# Altium schematic sheet [03] - POWER MANAGEMENT.SchDoc
size A3; DocumentNumber: 3; SheetNumber: 3; SheetTotal: 13; NameAuthor: Angle Vu
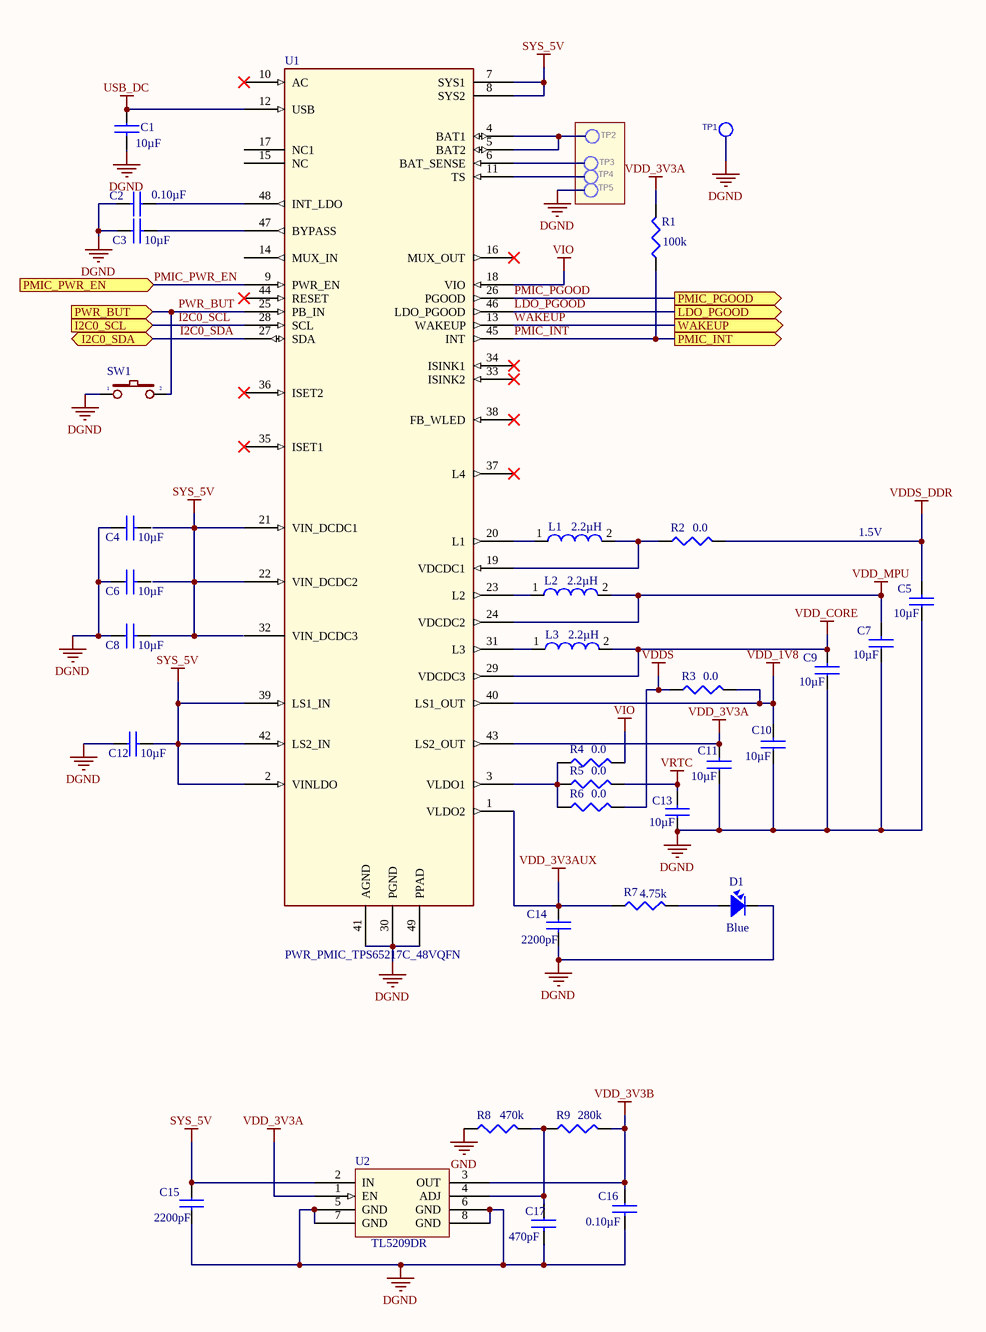
[diagram p0: [03] - POWER MANAGEMENT.SchDoc]

## Parts
C1  Capacitance: 10µF  (hidden comment: C_CER_10uF_10V_X7R_0805_10%)
C2  Capacitance: 0.10µF  (hidden comment: C_CER_0.1uF_6.3V_X5R_0402_10%)
C3  Capacitance: 10µF  (hidden comment: C_CER_10uF_10V_X7R_0805_10%)
C4  Capacitance: 10µF  (hidden comment: C_CER_10uF_10V_X7R_0805_10%)
C5  Capacitance: 10µF  (hidden comment: C_CER_10uF_10V_X7R_0805_10%)
C6  Capacitance: 10µF  (hidden comment: C_CER_10uF_10V_X7R_0805_10%)
C7  Capacitance: 10µF  (hidden comment: C_CER_10uF_10V_X7R_0805_10%)
C8  Capacitance: 10µF  (hidden comment: C_CER_10uF_10V_X7R_0805_10%)
C9  Capacitance: 10µF  (hidden comment: C_CER_10uF_10V_X7R_0805_10%)
C10  Capacitance: 10µF  (hidden comment: C_CER_10uF_10V_X7R_0805_10%)
C11  Capacitance: 10µF  (hidden comment: C_CER_10uF_10V_X7R_0805_10%)
C12  Capacitance: 10µF  (hidden comment: C_CER_10uF_10V_X7R_0805_10%)
C13  Capacitance: 10µF  (hidden comment: C_CER_10uF_10V_X7R_0805_10%)
C14  Capacitance: 2200pF  (hidden comment: C_CER_2200pF_10V_X5R_0402_10%)
C15  Capacitance: 2200pF  (hidden comment: C_CER_2200pF_10V_X5R_0402_10%)
C16  Capacitance: 0.10µF  (hidden comment: C_CER_0.1uF_6.3V_X5R_0402_10%)
C17  Capacitance: 470pF  (hidden comment: C_CER_470pF_50V_X7R_0402_10%)
D1  Color: Blue  (hidden comment: LED_BLUE_0603)
L1  Inductance: 2.2µH  (hidden comment: INDUCTOR_2.2uH_1.3A_1008_20%)
L2  Inductance: 2.2µH  (hidden comment: INDUCTOR_2.2uH_1.3A_1008_20%)
L3  Inductance: 2.2µH  (hidden comment: INDUCTOR_2.2uH_1.3A_1008_20%)
R1  Resistance (Ohms): 100k  (hidden comment: R_100k_1/16W_0402_1%)
R2  Resistance (Ohms): 0.0  (hidden comment: R_0OhM_1/16W_0402)
R3  Resistance (Ohms): 0.0  (hidden comment: R_0OhM_1/16W_0402)
R4  Resistance (Ohms): 0.0  (hidden comment: R_0OhM_1/16W_0402)
R5  Resistance (Ohms): 0.0  (hidden comment: R_0OhM_1/16W_0402)
R6  Resistance (Ohms): 0.0  (hidden comment: R_0OhM_1/16W_0402)
R7  Resistance (Ohms): 4.75k  (hidden comment: R_4.75K_1/16W_0402_1%)
R8  Resistance (Ohms): 470k  (hidden comment: R_470K_1/16W_0402_1%)
R9  Resistance (Ohms): 280k  (hidden comment: R_280K_1/16W_0402_1%)
SW1  SW2_DPST_SURFACE_5MM  [SW2-SMD]  (value not drawn)
TP1  TESTPT1  [TP60C_SMD]  (value not drawn)  (no BOM)
TP2  TESTPT1  [TP60C_SMD]  (value not drawn)  (no BOM)
TP3  TESTPT1  [TP60C_SMD]  (value not drawn)  (no BOM)
TP4  TESTPT1  [TP60C_SMD]  (value not drawn)  (no BOM)
TP5  TESTPT1  [TP60C_SMD]  (value not drawn)  (no BOM)
U1  PWR_PMIC_TPS65217C_48VQFN
U2  Manufacturer Part Number: TL5209DR  (hidden comment: PWR_LDO_TL5209D_0.5A_ADJ_8SOIC)

## Ports
I2C0_SCL (in), I2C0_SDA (bidir), LDO_PGOOD (out), PMIC_INT (out), PMIC_PGOOD (out), PMIC_PWR_EN (in), PWR_BUT (in), WAKEUP (out)

## Nets
DGND: C1.2 C2.2 C3.1 C4.1 C5.1 C6.1 C7.1 C8.1 C9.1 C10.1 C11.1 C12.1 C13.1 C14.2 C15.2 C16.2 C17.2 D1.2 SW1.1 TP1.1(TP) TP5.1(TP) U1.30(PGND) U1.41(AGND) U1.49(PPAD) U2.5(GND) U2.6(GND) U2.7(GND) U2.8(GND)
GND: R8.1
SYS_5V: C8.2 C12.2 C15.1 U1.2(VINLDO) U1.7(SYS1) U1.8(SYS2) U1.21(VIN_DCDC1) U1.22(VIN_DCDC2) U1.39(LS1_IN) U1.42(LS2_IN) U2.2(IN)
USB_DC: C1.1 U1.12(USB)
VDD_1V8: C10.2 R3.2 U1.40(LS1_OUT)
VDD_3V3A: C11.2 R1.2 U1.43(LS2_OUT) U2.1(EN)
VDD_3V3AUX: C14.1 R7.1 U1.1(VLDO2)
VDD_3V3B: C16.1 R9.2 U2.3(OUT)
VDD_CORE: C9.2 L3.2 U1.29(VDCDC3)
VDD_MPU: C7.2 L2.2 U1.24(VDCDC2)
VDDS: R3.1 R6.2
VDDS_DDR: C5.2 R2.2
VIO: R4.2 U1.18(VIO)
VRTC: C13.2 R5.2
I2C0_SCL: U1.28(SCL) ; port I2C0_SCL
I2C0_SDA: U1.27(SDA) ; port I2C0_SDA
LDO_PGOOD: U1.46(LDO_PGOOD) ; port LDO_PGOOD
PMIC_INT: R1.1 U1.45(INT) ; port PMIC_INT
PMIC_PGOOD: U1.26(PGOOD) ; port PMIC_PGOOD
PMIC_PWR_EN: U1.9(PWR_EN) ; port PMIC_PWR_EN
PWR_BUT: SW1.2 U1.25(PB_IN) ; port PWR_BUT
WAKEUP: U1.13(WAKEUP) ; port WAKEUP
NetC2_1: C2.1 U1.48(INT_LDO)
NetC3_2: C3.2 U1.47(BYPASS)
NetC17_1: C17.1 R8.2 R9.1 U2.4(ADJ)
NetD1_1: D1.1 R7.2
NetL1_1: L1.1 U1.20(L1)
NetL1_2: L1.2 R2.1 U1.19(VDCDC1)
NetL2_1: L2.1 U1.23(L2)
NetL3_1: L3.1 U1.31(L3)
NetR4_1: R4.1 R5.1 R6.1 U1.3(VLDO1)
NetTP2_1: TP2.1(TP) U1.4(BAT1) U1.5(BAT2)
NetTP3_1: TP3.1(TP) U1.6(BAT_SENSE)
NetTP4_1: TP4.1(TP) U1.11(TS)

Not connected (* = marked no-connect by the designer): C4 2; C6 2; U1 10(AC)* 14(MUX_IN) 15(NC) 16(MUX_OUT)* 17(NC1) 32(VIN_DCDC3) 33(ISINK2)* 34(ISINK1)* 35(ISET1)* 36(ISET2)* 37(L4)* 38(FB_WLED)* 44(RESET)*

## Notes on the sheet
- 1.5V
- Designed By
- Page Name:
- Checked By
- Size:
- A3
- Company:
- Address:
- Sheet:
- /

## Library data of the parts
C1 C3-C13 = C_CER_10uF_10V_X7R_0805_10%: CAP CER 10UF 10V X7R 0805; Manufacturer: Murata Electronics North America; Manufacturer Part Number: GRM21BR71A106KE51L; Tolerance: ±10%; Supplier 1: Digi-Key; RoHS: RoHS Compliant; Category: Capacitors; Stock 1: 966000; Pricing 1: 3000=0.05, 6000=0.04625, 9000=0.04375, 15000=0.0415, 30000=0.04, 75000=0.0375, 150000=0.03313 (USD); Packaging: Tape & Reel (TR); Part Status: Active; Temperature Coefficient: X7R; Operating Temperature: -55°C ~ 125°C; Features: -; Ratings: -; Applications: General Purpose; Failure Rate: *; Mounting Type: Surface Mount, MLCC; Package / Case: 0805 (2012 Metric); Size / Dimension: 0.079" L x 0.049" W (2.00mm x 1.25mm); Height - Seated (Max): -; Thickness (Max): 0.053" (1.35mm); Lead Spacing: -; Lead Style: -; ComponentLink1URL: http://www.murata.com/~/media/webrenewal/support/library/catalog/products/capacitor/mlcc/c02e.pdf; ComponentLink1Description: http://www.murata.com/~/media/webrenewal/support/library/catalog/products/capacitor/mlcc/c02e.pdf; Supplier Part Number 1: 490-3905-2-ND
C2 C16 = C_CER_0.1uF_6.3V_X5R_0402_10%: CAP CER 0.1UF 6.3V X5R 0402; Manufacturer: Murata Electronics North America; Manufacturer Part Number: GRM155R60J104KA01D; Tolerance: ±10%; Supplier 1: Digi-Key; RoHS: RoHS Compliant; Category: Capacitors; Stock 1: 370000; Pricing 1: 10000=0.0021, 20000=0.002, 30000=0.0019, 50000=0.0017, 100000=0.00138 (USD); Packaging: Tape & Reel (TR); Part Status: Active; Voltage - Rated: 6.3V; Temperature Coefficient: X5R; Operating Temperature: -55°C ~ 85°C; Features: -; Ratings: -; Applications: General Purpose; Failure Rate: *; Mounting Type: Surface Mount, MLCC; Package / Case: 0402 (1005 Metric); Size / Dimension: 0.039" L x 0.020" W (1.00mm x 0.50mm); Height - Seated (Max): -; Thickness (Max): 0.022" (0.55mm); Lead Spacing: -; Lead Style: -; ComponentLink1URL: http://www.murata.com/~/media/webrenewal/support/library/catalog/products/capacitor/mlcc/c02e.pdf; ComponentLink1Description: http://www.murata.com/~/media/webrenewal/support/library/catalog/products/capacitor/mlcc/c02e.pdf; Supplier Part Number 1: 490-6287-2-ND
C14 C15 = C_CER_2200pF_10V_X5R_0402_10%: CAP CER 2200PF 10V X5R 0402; Manufacturer: Murata Electronics North America; Manufacturer Part Number: GRM155R61A222KA01D; Tolerance: ±10%; Supplier 1: Digi-Key; RoHS: RoHS Compliant; Category: Capacitors; Stock 1: 30000; Pricing 1: 10000=0.00399, 20000=0.0038, 30000=0.00361, 50000=0.00323, 100000=0.00261 (USD); Packaging: Tape & Reel (TR); Part Status: Active; Voltage - Rated: 10V; Temperature Coefficient: X5R; Operating Temperature: -55°C ~ 85°C; Features: -; Ratings: -; Applications: General Purpose; Failure Rate: *; Mounting Type: Surface Mount, MLCC; Package / Case: 0402 (1005 Metric); Size / Dimension: 0.039" L x 0.020" W (1.00mm x 0.50mm); Height - Seated (Max): -; Thickness (Max): 0.022" (0.55mm); Lead Spacing: -; Lead Style: -; ComponentLink1URL: http://www.murata.com/~/media/webrenewal/support/library/catalog/products/capacitor/mlcc/c02e.pdf; ComponentLink1Description: http://www.murata.com/~/media/webrenewal/support/library/catalog/products/capacitor/mlcc/c02e.pdf; Supplier Part Number 1: 490-8251-2-ND
C17 = C_CER_470pF_50V_X7R_0402_10%: CAP CER 470PF 50V X7R 0402; Manufacturer: Murata Electronics North America; Manufacturer Part Number: GRM155R71H471KA01D; Tolerance: ±10%; Supplier 1: Digi-Key; RoHS: RoHS Compliant; Category: Capacitors; Stock 1: 654393; Pricing 1: 1=0.1, 10=0.018, 50=0.0098, 100=0.0083, 250=0.00676, 500=0.00578, 1000=0.0045, 5000=0.00375 (USD); Packaging: Cut Tape (CT); Part Status: Active; Voltage - Rated: 50V; Temperature Coefficient: X7R; Operating Temperature: -55°C ~ 125°C; Features: -; Ratings: -; Applications: General Purpose; Failure Rate: *; Mounting Type: Surface Mount, MLCC; Package / Case: 0402 (1005 Metric); Size / Dimension: 0.039" L x 0.020" W (1.00mm x 0.50mm); Height - Seated (Max): -; Thickness (Max): 0.022" (0.55mm); Lead Spacing: -; Lead Style: -; ComponentLink1URL: http://www.murata.com/~/media/webrenewal/support/library/catalog/products/capacitor/mlcc/c02e.pdf; ComponentLink1Description: http://www.murata.com/~/media/webrenewal/support/library/catalog/products/capacitor/mlcc/c02e.pdf; Supplier Part Number 1: 490-1300-1-ND
D1 = LED_BLUE_0603: LED BLUE CLEAR 0603 SMD; Manufacturer: Lite-On Inc.; Manufacturer Part Number: LTST-C191TBKT; Lens Color: Colorless; Millicandela Rating: 104mcd; Lens Style/Size: Rectangle with Flat Top, 1.10mm x 0.80mm; Voltage - Forward (Vf) (Typ): 3.3V; Current - Test: 20mA; Viewing Angle: 130°; Wavelength - Dominant: 470nm; Wavelength - Peak: 468nm; Supplier 1: Digi-Key; RoHS: RoHS Compliant; Category: Optoelectronics; Stock 1: 135000; Pricing 1: 5000=0.0684, 10000=0.0608, 25000=0.057, 50000=0.0513, 125000=0.0494 (USD); Packaging: Tape & Reel (TR); Part Status: Active; Lens Transparency: Clear; Mounting Type: Surface Mount; Features: -; Package / Case: 0603 (1608 Metric); Supplier Device Package: *; Size / Dimension: 1.60mm L x 0.80mm W; Height (Max): 0.55mm; ComponentLink1URL: http://optoelectronics.liteon.com/upload/download/DS22-2000-230/S_110_LTST-C191TBKT.pdf; ComponentLink1Description: http://optoelectronics.liteon.com/upload/download/DS22-2000-230/S_110_LTST-C191TBKT.pdf
L1-L3 = INDUCTOR_2.2uH_1.3A_1008_20%: FIXED IND 2.2UH 1.3A 80 MOHM SMD; Manufacturer: Murata Electronics North America; Manufacturer Part Number: LQM2HPN2R2MG0L; Type: Multilayer; Material - Core: Ferrite; Tolerance: ±20%; Shielding: Shielded; DC Resistance (DCR): 100 mOhm Max; Frequency - Self Resonant: 40MHz; Frequency - Test: 1MHz; Supplier 1: Digi-Key; RoHS: RoHS Compliant; Category: Inductors, Coils, Chokes; Stock 1: 216000; Pricing 1: 3000=0.11594, 6000=0.10912, 15000=0.10571, 30000=0.1023, 75000=0.09889, 150000=0.09548 (USD); Packaging: Tape & Reel (TR); Part Status: Active; Current Rating: 1.3A; Current - Saturation: -; Q @ Freq: -; Ratings: -; Operating Temperature: -55°C ~ 125°C; Mounting Type: Surface Mount; Package / Case: 1008 (2520 Metric); Size / Dimension: 0.098" L x 0.079" W (2.50mm x 2.00mm); Height - Seated (Max): 0.039" (1.00mm); ComponentLink1URL: http://search.murata.co.jp/Ceramy/image/img/PDF/ENG/L0075S0104LQM2HP_G0.pdf; ComponentLink1Description: http://search.murata.co.jp/Ceramy/image/img/PDF/ENG/L0075S0104LQM2HP_G0.pdf; Supplier Part Number 1: 490-5114-2-ND
R1 = R_100k_1/16W_0402_1%: RES SMD 100K OHM 1% 1/16W 0402; Manufacturer: Vishay Dale; Manufacturer Part Number: CRCW0402100KFKED; Power (Watts): 0.063W, 1/16W; Temperature Coefficient: ±100ppm/°C; Supplier 1: Digi-Key; RoHS: RoHS Compliant; Category: Resistors; Stock 1: 1287000; Pricing 1: 10000=0.0033, 30000=0.0029, 50000=0.00266, 100000=0.00261 (USD); Packaging: Tape & Reel (TR); Part Status: Active; Tolerance: ±1%; Composition: Thick Film; Features: Automotive AEC-Q200; Operating Temperature: -55°C ~ 155°C; Package / Case: 0402 (1005 Metric); Supplier Device Package: 0402; Size / Dimension: 0.039" L x 0.020" W (1.00mm x 0.50mm); Height: 0.016" (0.40mm); Number of Terminations: 2; Failure Rate: -; ComponentLink1URL: http://www.vishay.com/docs/20035/dcrcwe3.pdf; ComponentLink1Description: http://www.vishay.com/docs/20035/dcrcwe3.pdf; Supplier Part Number 1: 541-100KLTR-ND
R2-R6 = R_0OhM_1/16W_0402: RES SMD 0.0OHM JUMPER 1/16W 0402; Manufacturer: Yageo; Manufacturer Part Number: RC0402JR-070RL; Power (Watts): 0.063W, 1/16W; Supplier 1: Digi-Key; RoHS: RoHS Compliant; Category: Resistors; Stock 1: 13978228; Pricing 1: 1=0.1, 10=0.013, 25=0.0092, 100=0.0053, 250=0.004, 500=0.0032, 1000=0.00236, 2500=0.00205, 5000=0.00169 (USD); Packaging: Cut Tape (CT); Part Status: Active; Tolerance: Jumper; Composition: Thick Film; Features: Moisture Resistant; Temperature Coefficient: -; Operating Temperature: -55°C ~ 155°C; Package / Case: 0402 (1005 Metric); Supplier Device Package: 0402; Size / Dimension: 0.039" L x 0.020" W (1.00mm x 0.50mm); Height: 0.016" (0.40mm); Number of Terminations: 2; Failure Rate: -; ComponentLink1URL: http://www.yageo.com/documents/recent/PYu-RC_Group_51_RoHS_L_04.pdf; ComponentLink1Description: http://www.yageo.com/documents/recent/PYu-RC_Group_51_RoHS_L_04.pdf; Supplier Part Number 1: 311-0.0JRCT-ND
R7 = R_4.75K_1/16W_0402_1%: RES SMD 4.75K OHM 1% 1/16W 0402; Manufacturer: Vishay Dale; Manufacturer Part Number: CRCW04024K75FKED; Power (Watts): 0.063W, 1/16W; Temperature Coefficient: ±100ppm/°C; Supplier 1: Digi-Key; RoHS: RoHS Compliant; Category: Resistors; Stock 1: 360000; Pricing 1: 10000=0.0033, 30000=0.0029, 50000=0.00266, 100000=0.00261 (USD); Packaging: Tape & Reel (TR); Part Status: Active; Tolerance: ±1%; Composition: Thick Film; Features: Automotive AEC-Q200; Operating Temperature: -55°C ~ 155°C; Package / Case: 0402 (1005 Metric); Supplier Device Package: 0402; Size / Dimension: 0.039" L x 0.020" W (1.00mm x 0.50mm); Height: 0.016" (0.40mm); Number of Terminations: 2; Failure Rate: -; ComponentLink1URL: http://www.vishay.com/docs/20035/dcrcwe3.pdf; ComponentLink1Description: http://www.vishay.com/docs/20035/dcrcwe3.pdf; Supplier Part Number 1: 541-4.75KLTR-ND
R8 = R_470K_1/16W_0402_1%: RES SMD 470K OHM 1% 1/16W 0402; Manufacturer: Vishay Dale; Manufacturer Part Number: CRCW0402470KFKED; Power (Watts): 0.063W, 1/16W; Temperature Coefficient: ±100ppm/°C; Supplier 1: Digi-Key; RoHS: RoHS Compliant; Category: Resistors; Stock 1: 140000; Pricing 1: 10000=0.0033, 30000=0.0029, 50000=0.00266, 100000=0.00261 (USD); Packaging: Tape & Reel (TR); Part Status: Active; Tolerance: ±1%; Composition: Thick Film; Features: Automotive AEC-Q200; Operating Temperature: -55°C ~ 155°C; Package / Case: 0402 (1005 Metric); Supplier Device Package: 0402; Size / Dimension: 0.039" L x 0.020" W (1.00mm x 0.50mm); Height: 0.016" (0.40mm); Number of Terminations: 2; Failure Rate: -; ComponentLink1URL: http://www.vishay.com/docs/20035/dcrcwe3.pdf; ComponentLink1Description: http://www.vishay.com/docs/20035/dcrcwe3.pdf; Supplier Part Number 1: 541-470KLTR-ND
R9 = R_280K_1/16W_0402_1%: RES SMD 280K OHM 1% 1/16W 0402; Manufacturer: Vishay Dale; Manufacturer Part Number: CRCW0402280KFKED; Power (Watts): 0.063W, 1/16W; Temperature Coefficient: ±100ppm/°C; Supplier 1: Digi-Key; RoHS: RoHS Compliant; Category: Resistors; Stock 1: 50000; Pricing 1: 10000=0.0033, 30000=0.0029, 50000=0.00266, 100000=0.00261 (USD); Packaging: Tape & Reel (TR); Part Status: Active; Tolerance: ±1%; Composition: Thick Film; Features: Automotive AEC-Q200; Operating Temperature: -55°C ~ 155°C; Package / Case: 0402 (1005 Metric); Supplier Device Package: 0402; Size / Dimension: 0.039" L x 0.020" W (1.00mm x 0.50mm); Height: 0.016" (0.40mm); Number of Terminations: 2; Failure Rate: -; ComponentLink1URL: http://www.vishay.com/docs/20035/dcrcwe3.pdf; ComponentLink1Description: http://www.vishay.com/docs/20035/dcrcwe3.pdf; Supplier Part Number 1: 541-280KLTR-ND
SW1 = SW2_DPST_SURFACE_5MM: SWITCH TACTILE SPST-NO 0.05A 12V; Manufacturer: Wurth Electronics Inc; Manufacturer Part Number: 434121050836; Switch Function: Off-Mom; Contact Rating @ Voltage: 0.05A @ 12VDC; Actuator Type: Rectangular Button; Actuator Height off PCB, from Pins: 5.00mm; Actuator Orientation: Top Actuated; Outline: 6.00mm x 3.50mm; Illumination: Non-Illuminated; Operating Force: 360gf; Actuator Material: Liquid Crystal Polymer (LCP); Switch Travel: 0.25mm; Mechanical Life: 50,000 Cycles; Supplier 1: Digi-Key; RoHS: RoHS Compliant; Category: Switches; Stock 1: 0; Pricing 1: 1500=0.27 (USD); Packaging: Tape & Reel (TR); Part Status: Active; Circuit: SPST-NO; Mounting Type: Surface Mount; Termination Style: SMD (SMT) Tab; Illumination Voltage (Nominal): -; Illumination Type, Color: -; Ingress Protection: -; Features: -; Operating Temperature: -40°C ~ 85°C; ComponentLink1URL: http://katalog.we-online.de/em/datasheet/434121050836.pdf; ComponentLink1Description: http://katalog.we-online.de/em/datasheet/434121050836.pdf; Supplier Part Number 1: 732-7049-2-ND
TP1-TP5 = TESTPT1_2
U1 = PWR_PMIC_TPS65217C_48VQFN: IC PMIC BATT PWR SYST 48VQFN; Manufacturer: Texas Instruments; Manufacturer Part Number: TPS65217CRSLR; Voltage - Supply: 2.75 V ~ 5.8 V; Supplier 1: Digi-Key; RoHS: RoHS Compliant; Category: Integrated Circuits (ICs); Stock 1: 2500; Pricing 1: 2500=2.29 (USD); Packaging: Tape & Reel (TR); Part Status: Active; Applications: Battery Management, Display (LED Drivers), Handheld/Mobile Devices, Power Supply; Current - Supply: -; Operating Temperature: -40°C ~ 105°C; Mounting Type: Surface Mount; Package / Case: 48-VFQFN Exposed Pad; Supplier Device Package: 48-VQFN (6x6); ComponentLink1URL: http://www.ti.com/lit/ds/symlink/tps65217.pdf; ComponentLink1Description: http://www.ti.com/lit/ds/symlink/tps65217.pdf; Supplier Part Number 1: 296-34814-2-ND
U2 = PWR_LDO_TL5209D_0.5A_ADJ_8SOIC: IC REG LDO ADJ 0.5A 8SOIC; Manufacturer: Texas Instruments; Regulator Topology: Positive Adjustable; Voltage - Output: 2.5 V ~ 6.5 V; Current - Output: 500mA; Voltage - Dropout (Typical): 0.35V @ 500mA; Number of Regulators: 1; Voltage - Input: 2.5 V ~ 16 V; Supplier 1: Digi-Key; RoHS: RoHS Compliant; Category: Integrated Circuits (ICs); Stock 1: 17500; Pricing 1: 2500=0.546, 5000=0.5187, 12500=0.4992, 25000=0.4875 (USD); Packaging: Tape & Reel (TR); Part Status: Active; Current - Limit (Min): -; Operating Temperature: -40°C ~ 125°C; Mounting Type: Surface Mount; Package / Case: 8-SOIC (0.154", 3.90mm Width); Supplier Device Package: 8-SOIC; ComponentLink1URL: http://media.digikey.com/pdf/Data%20Sheets/Texas%20Instruments%20PDFs/TL5209.pdf; ComponentLink1Description: http://media.digikey.com/pdf/Data%20Sheets/Texas%20Instruments%20PDFs/TL5209.pdf; Supplier Part Number 1: 296-21569-2-ND